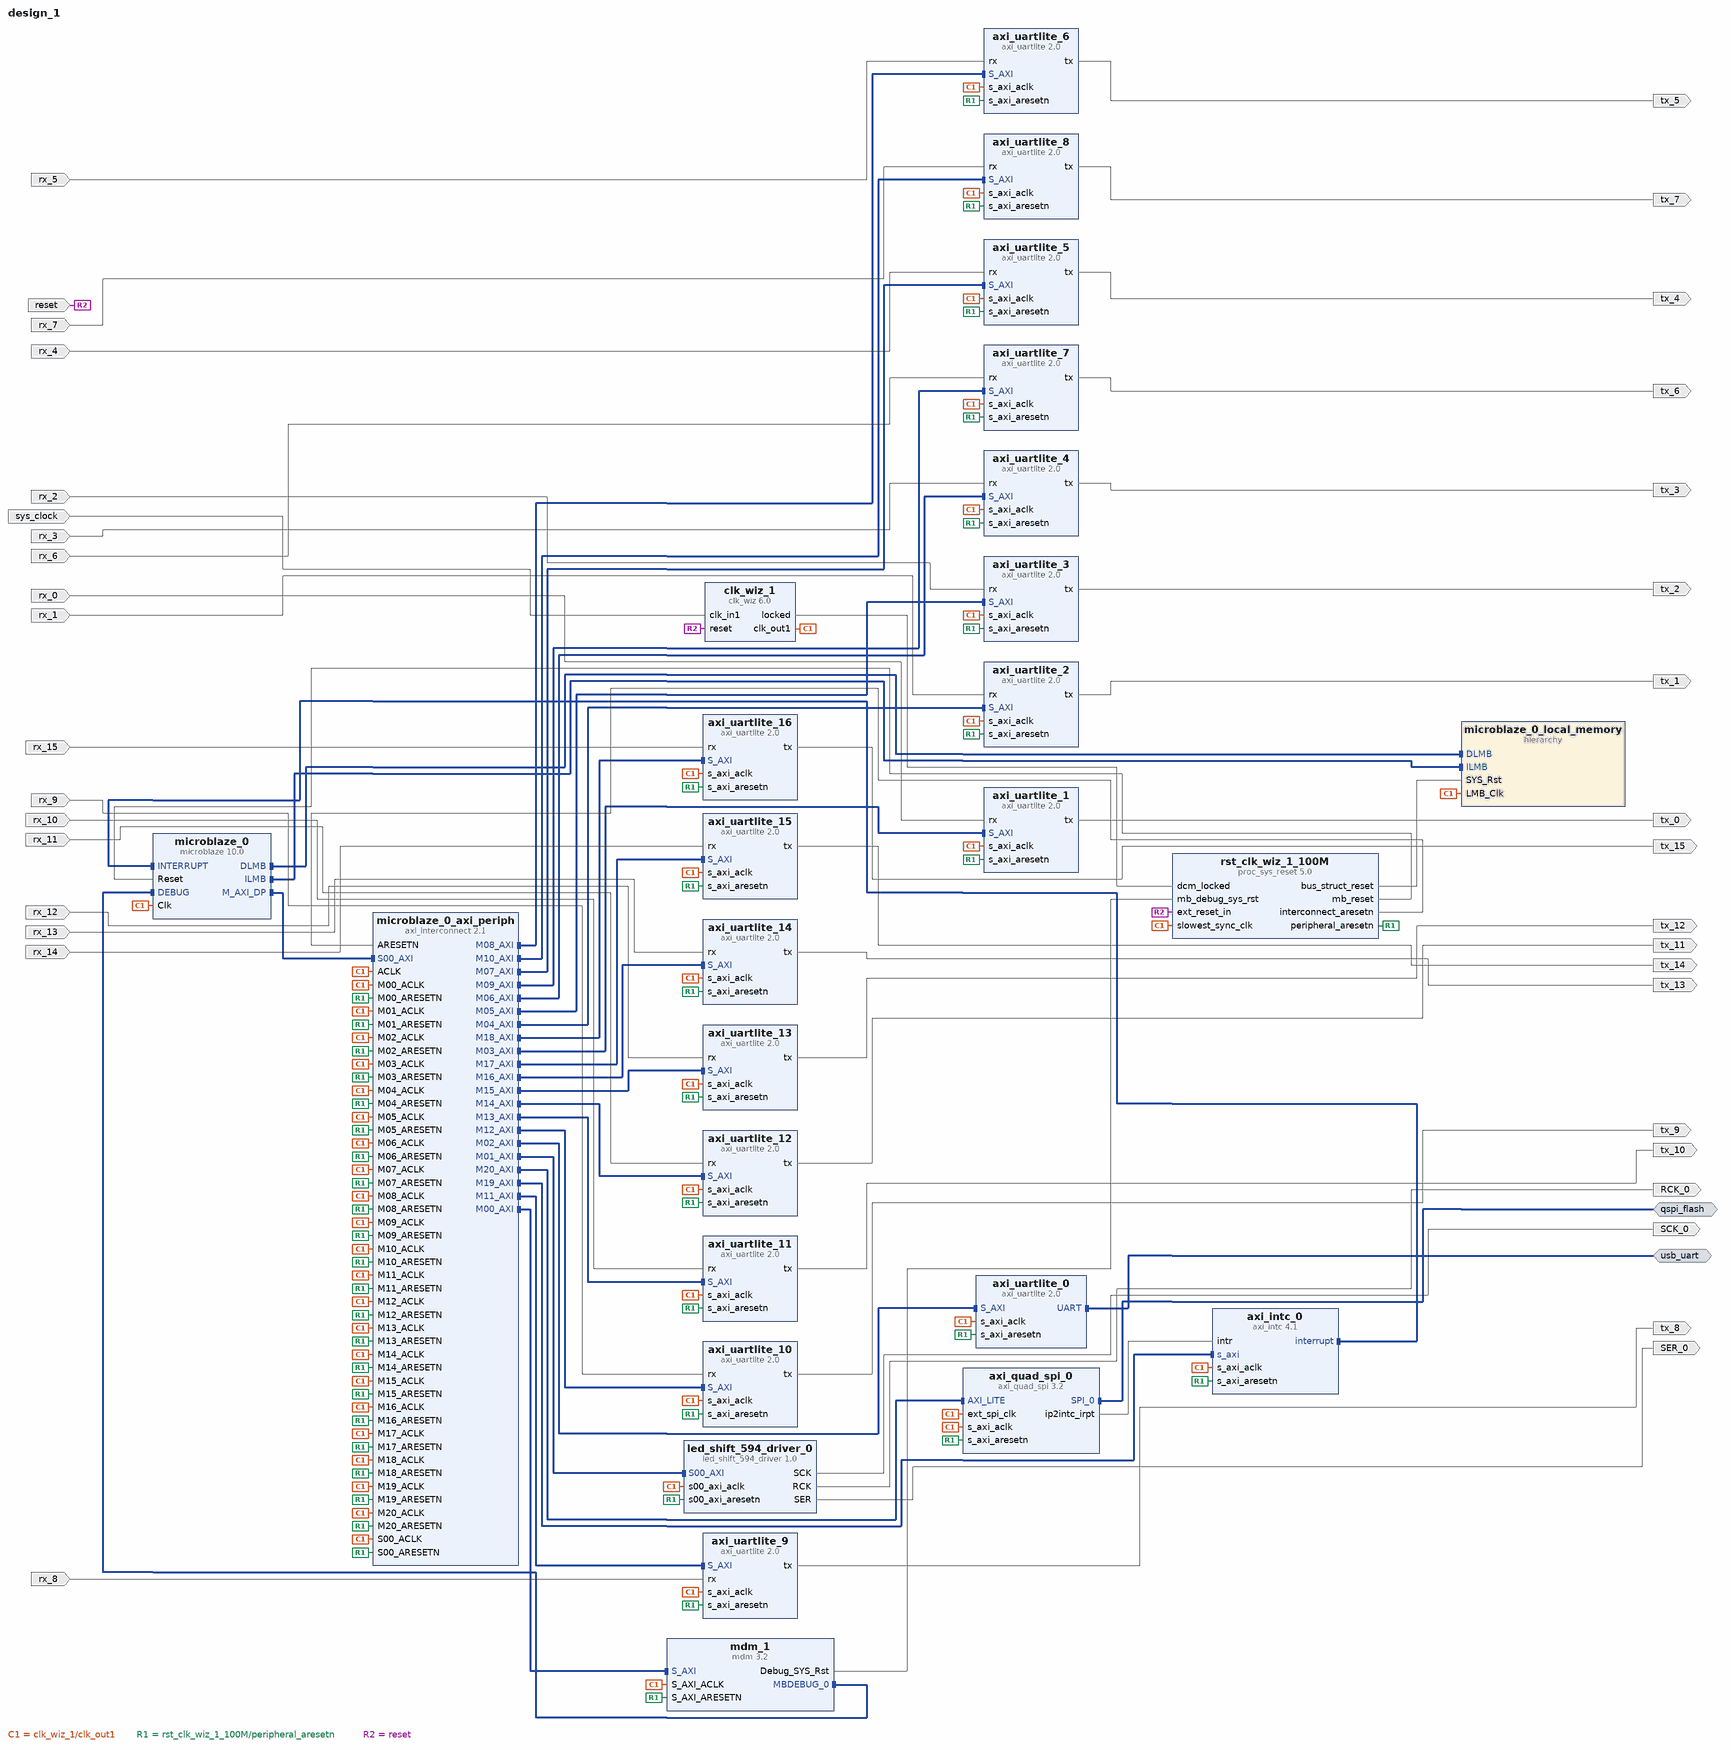
[diagram p0: block diagram of the top level]
# Vivado block design design_1, xc7a35tcpg236-1, Vivado 2018.2
create_bd_design design_1

create_bd_intf_port -mode Master -vlnv xilinx.com:interface:uart_rtl:1.0 usb_uart
create_bd_intf_port -mode Master -vlnv xilinx.com:interface:spi_rtl:1.0 qspi_flash
create_bd_port -dir I -type rst reset
set_property -dict {CONFIG.POLARITY ACTIVE_HIGH} [get_bd_ports reset]
create_bd_port -dir O SCK_0
create_bd_port -dir O RCK_0
create_bd_port -dir O SER_0
create_bd_port -dir I -type clk sys_clock
set_property -dict {CONFIG.FREQ_HZ 12000000 CONFIG.PHASE 0.000} [get_bd_ports sys_clock]
create_bd_port -dir I rx_0
create_bd_port -dir O tx_0
create_bd_port -dir I rx_1
create_bd_port -dir O tx_1
create_bd_port -dir I rx_2
create_bd_port -dir O tx_2
create_bd_port -dir I rx_3
create_bd_port -dir O tx_3
create_bd_port -dir I rx_4
create_bd_port -dir O tx_4
create_bd_port -dir I rx_5
create_bd_port -dir O tx_5
create_bd_port -dir I rx_6
create_bd_port -dir O tx_6
create_bd_port -dir I rx_7
create_bd_port -dir O tx_7
create_bd_port -dir I rx_8
create_bd_port -dir O tx_8
create_bd_port -dir I rx_9
create_bd_port -dir O tx_9
create_bd_port -dir I rx_10
create_bd_port -dir O tx_10
create_bd_port -dir I rx_11
create_bd_port -dir O tx_11
create_bd_port -dir I rx_12
create_bd_port -dir O tx_12
create_bd_port -dir I rx_13
create_bd_port -dir O tx_13
create_bd_port -dir I rx_14
create_bd_port -dir O tx_14
create_bd_port -dir I rx_15
create_bd_port -dir O tx_15

create_bd_cell -type hier microblaze_0_local_memory
create_bd_cell -type ip -vlnv xilinx.com:ip:axi_intc:4.1 axi_intc_0
create_bd_cell -type ip -vlnv xilinx.com:ip:axi_quad_spi:3.2 axi_quad_spi_0
set_property -dict [list \
  CONFIG.C_SPI_MEMORY 2 \
  CONFIG.C_SPI_MODE 2 \
  CONFIG.USE_BOARD_FLOW true \
  CONFIG.QSPI_BOARD_INTERFACE qspi_flash \
  CONFIG.C_S_AXI4_ID_WIDTH 0 \
] [get_bd_cells axi_quad_spi_0]
create_bd_cell -type ip -vlnv xilinx.com:ip:axi_uartlite:2.0 axi_uartlite_0
set_property -dict {CONFIG.USE_BOARD_FLOW true CONFIG.UARTLITE_BOARD_INTERFACE usb_uart} [get_bd_cells axi_uartlite_0]
create_bd_cell -type ip -vlnv xilinx.com:ip:axi_uartlite:2.0 axi_uartlite_10
set_property -dict {CONFIG.C_BAUDRATE 31250} [get_bd_cells axi_uartlite_10]
create_bd_cell -type ip -vlnv xilinx.com:ip:axi_uartlite:2.0 axi_uartlite_11
set_property -dict {CONFIG.C_BAUDRATE 31250} [get_bd_cells axi_uartlite_11]
create_bd_cell -type ip -vlnv xilinx.com:ip:axi_uartlite:2.0 axi_uartlite_12
set_property -dict {CONFIG.C_BAUDRATE 31250} [get_bd_cells axi_uartlite_12]
create_bd_cell -type ip -vlnv xilinx.com:ip:axi_uartlite:2.0 axi_uartlite_13
set_property -dict {CONFIG.C_BAUDRATE 31250} [get_bd_cells axi_uartlite_13]
create_bd_cell -type ip -vlnv xilinx.com:ip:axi_uartlite:2.0 axi_uartlite_14
set_property -dict {CONFIG.C_BAUDRATE 31250} [get_bd_cells axi_uartlite_14]
create_bd_cell -type ip -vlnv xilinx.com:ip:axi_uartlite:2.0 axi_uartlite_15
set_property -dict {CONFIG.C_BAUDRATE 31250} [get_bd_cells axi_uartlite_15]
create_bd_cell -type ip -vlnv xilinx.com:ip:axi_uartlite:2.0 axi_uartlite_16
set_property -dict {CONFIG.C_BAUDRATE 31250} [get_bd_cells axi_uartlite_16]
create_bd_cell -type ip -vlnv xilinx.com:ip:axi_uartlite:2.0 axi_uartlite_1
set_property -dict {CONFIG.C_BAUDRATE 31250} [get_bd_cells axi_uartlite_1]
create_bd_cell -type ip -vlnv xilinx.com:ip:axi_uartlite:2.0 axi_uartlite_2
set_property -dict {CONFIG.C_BAUDRATE 31250} [get_bd_cells axi_uartlite_2]
create_bd_cell -type ip -vlnv xilinx.com:ip:axi_uartlite:2.0 axi_uartlite_3
set_property -dict {CONFIG.C_BAUDRATE 31250} [get_bd_cells axi_uartlite_3]
create_bd_cell -type ip -vlnv xilinx.com:ip:axi_uartlite:2.0 axi_uartlite_4
set_property -dict {CONFIG.C_BAUDRATE 31250} [get_bd_cells axi_uartlite_4]
create_bd_cell -type ip -vlnv xilinx.com:ip:axi_uartlite:2.0 axi_uartlite_5
set_property -dict {CONFIG.C_BAUDRATE 31250} [get_bd_cells axi_uartlite_5]
create_bd_cell -type ip -vlnv xilinx.com:ip:axi_uartlite:2.0 axi_uartlite_6
set_property -dict {CONFIG.C_BAUDRATE 31250} [get_bd_cells axi_uartlite_6]
create_bd_cell -type ip -vlnv xilinx.com:ip:axi_uartlite:2.0 axi_uartlite_7
set_property -dict {CONFIG.C_BAUDRATE 31250} [get_bd_cells axi_uartlite_7]
create_bd_cell -type ip -vlnv xilinx.com:ip:axi_uartlite:2.0 axi_uartlite_8
set_property -dict {CONFIG.C_BAUDRATE 31250} [get_bd_cells axi_uartlite_8]
create_bd_cell -type ip -vlnv xilinx.com:ip:axi_uartlite:2.0 axi_uartlite_9
set_property -dict {CONFIG.C_BAUDRATE 31250} [get_bd_cells axi_uartlite_9]
create_bd_cell -type ip -vlnv xilinx.com:ip:clk_wiz:6.0 clk_wiz_1
set_property -dict [list \
  CONFIG.PRIM_IN_FREQ 12.000 \
  CONFIG.CLKIN1_JITTER_PS 833.33 \
  CONFIG.PRIM_SOURCE Single_ended_clock_capable_pin \
  CONFIG.MMCM_DIVCLK_DIVIDE 1 \
  CONFIG.MMCM_CLKFBOUT_MULT_F 62.500 \
  CONFIG.MMCM_CLKIN1_PERIOD 83.333 \
  CONFIG.MMCM_CLKIN2_PERIOD 10.0 \
  CONFIG.MMCM_CLKOUT0_DIVIDE_F 7.500 \
  CONFIG.USE_BOARD_FLOW true \
  CONFIG.CLK_IN1_BOARD_INTERFACE sys_clock \
  CONFIG.RESET_BOARD_INTERFACE reset \
  CONFIG.CLKOUT1_JITTER 479.872 \
  CONFIG.CLKOUT1_PHASE_ERROR 668.310 \
] [get_bd_cells clk_wiz_1]
create_bd_cell -type ip -vlnv xilinx.com:ip:mdm:3.2 mdm_1
set_property -dict {CONFIG.C_USE_UART 1} [get_bd_cells mdm_1]
create_bd_cell -type ip -vlnv xilinx.com:ip:microblaze:10.0 microblaze_0
set_property -dict {CONFIG.C_D_AXI 1 CONFIG.C_D_LMB 1 CONFIG.C_I_LMB 1 CONFIG.C_DEBUG_ENABLED 1} [get_bd_cells microblaze_0]
create_bd_cell -type ip -vlnv xilinx.com:ip:axi_interconnect:2.1 microblaze_0_axi_periph
set_property -dict {CONFIG.NUM_MI 21} [get_bd_cells microblaze_0_axi_periph]
create_bd_cell -type ip -vlnv xilinx.com:ip:proc_sys_reset:5.0 rst_clk_wiz_1_100M
set_property -dict {CONFIG.USE_BOARD_FLOW true CONFIG.RESET_BOARD_INTERFACE reset} [get_bd_cells rst_clk_wiz_1_100M]
create_bd_cell -type ip -vlnv user.org:user:led_shift_594_driver:1.0 led_shift_594_driver_0
set_property -dict [list \
  CONFIG.ANIMATION_IDLE_WIDTH 31 \
  CONFIG.ANIMATION_CLOCK_WIDTH 23 \
  CONFIG.SHIFT_DELAY_WIDTH 11 \
  CONFIG.LED_DELAY_WIDTH 2 \
  CONFIG.LED_CLOCK_WIDTH 19 \
] [get_bd_cells led_shift_594_driver_0]

# ---- hierarchy /microblaze_0_local_memory ----
current_bd_instance /microblaze_0_local_memory
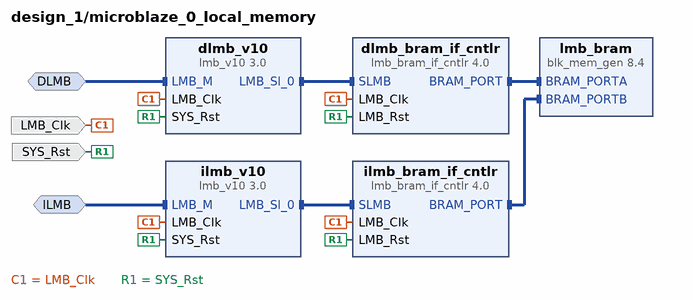
[diagram p1: block diagram inside /microblaze_0_local_memory]
create_bd_intf_pin -mode MirroredMaster -vlnv xilinx.com:interface:lmb_rtl:1.0 DLMB
create_bd_intf_pin -mode MirroredMaster -vlnv xilinx.com:interface:lmb_rtl:1.0 ILMB
create_bd_pin -dir I -type clk LMB_Clk
create_bd_pin -dir I -type rst SYS_Rst

create_bd_cell -type ip -vlnv xilinx.com:ip:lmb_bram_if_cntlr:4.0 dlmb_bram_if_cntlr
set_property -dict {CONFIG.C_ECC 0} [get_bd_cells dlmb_bram_if_cntlr]
create_bd_cell -type ip -vlnv xilinx.com:ip:lmb_v10:3.0 dlmb_v10
create_bd_cell -type ip -vlnv xilinx.com:ip:lmb_bram_if_cntlr:4.0 ilmb_bram_if_cntlr
set_property -dict {CONFIG.C_ECC 0} [get_bd_cells ilmb_bram_if_cntlr]
create_bd_cell -type ip -vlnv xilinx.com:ip:lmb_v10:3.0 ilmb_v10
create_bd_cell -type ip -vlnv xilinx.com:ip:blk_mem_gen:8.4 lmb_bram
set_property -dict [list \
  CONFIG.Memory_Type True_Dual_Port_RAM \
  CONFIG.Enable_B Use_ENB_Pin \
  CONFIG.Use_RSTB_Pin true \
  CONFIG.Port_B_Clock 100 \
  CONFIG.Port_B_Write_Rate 50 \
  CONFIG.Port_B_Enable_Rate 100 \
  CONFIG.use_bram_block BRAM_Controller \
] [get_bd_cells lmb_bram]

# ---- connections ----

current_bd_instance /microblaze_0_local_memory
connect_bd_intf_net -intf_net microblaze_0_dlmb_bus [get_bd_intf_pins dlmb_v10/LMB_Sl_0] [get_bd_intf_pins dlmb_bram_if_cntlr/SLMB]
connect_bd_intf_net -intf_net microblaze_0_ilmb_bus [get_bd_intf_pins ilmb_v10/LMB_Sl_0] [get_bd_intf_pins ilmb_bram_if_cntlr/SLMB]
connect_bd_intf_net -intf_net microblaze_0_dlmb_cntlr [get_bd_intf_pins dlmb_bram_if_cntlr/BRAM_PORT] [get_bd_intf_pins lmb_bram/BRAM_PORTA]
connect_bd_intf_net -intf_net microblaze_0_ilmb_cntlr [get_bd_intf_pins ilmb_bram_if_cntlr/BRAM_PORT] [get_bd_intf_pins lmb_bram/BRAM_PORTB]
connect_bd_intf_net -intf_net microblaze_0_dlmb [get_bd_intf_pins DLMB] [get_bd_intf_pins dlmb_v10/LMB_M]
connect_bd_intf_net -intf_net microblaze_0_ilmb [get_bd_intf_pins ILMB] [get_bd_intf_pins ilmb_v10/LMB_M]
connect_bd_net -net microblaze_0_Clk [get_bd_pins LMB_Clk] \
  [get_bd_pins dlmb_bram_if_cntlr/LMB_Clk] [get_bd_pins dlmb_v10/LMB_Clk] [get_bd_pins ilmb_bram_if_cntlr/LMB_Clk] \
  [get_bd_pins ilmb_v10/LMB_Clk]
connect_bd_net [get_bd_pins SYS_Rst] \
  [get_bd_pins dlmb_bram_if_cntlr/LMB_Rst] [get_bd_pins dlmb_v10/SYS_Rst] [get_bd_pins ilmb_bram_if_cntlr/LMB_Rst] \
  [get_bd_pins ilmb_v10/SYS_Rst]

current_bd_instance /
connect_bd_intf_net [get_bd_intf_pins microblaze_0/DLMB] [get_bd_intf_pins microblaze_0_local_memory/DLMB]
connect_bd_intf_net [get_bd_intf_pins microblaze_0/ILMB] [get_bd_intf_pins microblaze_0_local_memory/ILMB]
connect_bd_intf_net -intf_net microblaze_0_axi_dp [get_bd_intf_pins microblaze_0_axi_periph/S00_AXI] [get_bd_intf_pins microblaze_0/M_AXI_DP]
connect_bd_intf_net [get_bd_intf_pins mdm_1/MBDEBUG_0] [get_bd_intf_pins microblaze_0/DEBUG]
connect_bd_intf_net -intf_net microblaze_0_mdm_axi [get_bd_intf_pins microblaze_0_axi_periph/M00_AXI] [get_bd_intf_pins mdm_1/S_AXI]
connect_bd_intf_net [get_bd_intf_pins microblaze_0_axi_periph/M01_AXI] [get_bd_intf_pins led_shift_594_driver_0/S00_AXI]
connect_bd_intf_net [get_bd_intf_pins microblaze_0_axi_periph/M02_AXI] [get_bd_intf_pins axi_uartlite_0/S_AXI]
connect_bd_intf_net [get_bd_intf_pins microblaze_0_axi_periph/M03_AXI] [get_bd_intf_pins axi_uartlite_1/S_AXI]
connect_bd_intf_net [get_bd_intf_pins microblaze_0_axi_periph/M04_AXI] [get_bd_intf_pins axi_uartlite_2/S_AXI]
connect_bd_intf_net [get_bd_intf_pins microblaze_0_axi_periph/M05_AXI] [get_bd_intf_pins axi_uartlite_3/S_AXI]
connect_bd_intf_net [get_bd_intf_pins microblaze_0_axi_periph/M06_AXI] [get_bd_intf_pins axi_uartlite_4/S_AXI]
connect_bd_intf_net [get_bd_intf_pins microblaze_0_axi_periph/M07_AXI] [get_bd_intf_pins axi_uartlite_5/S_AXI]
connect_bd_intf_net [get_bd_intf_pins microblaze_0_axi_periph/M08_AXI] [get_bd_intf_pins axi_uartlite_6/S_AXI]
connect_bd_intf_net [get_bd_intf_pins microblaze_0_axi_periph/M09_AXI] [get_bd_intf_pins axi_uartlite_7/S_AXI]
connect_bd_intf_net [get_bd_intf_pins microblaze_0_axi_periph/M10_AXI] [get_bd_intf_pins axi_uartlite_8/S_AXI]
connect_bd_intf_net [get_bd_intf_pins microblaze_0_axi_periph/M11_AXI] [get_bd_intf_pins axi_uartlite_9/S_AXI]
connect_bd_intf_net [get_bd_intf_pins microblaze_0_axi_periph/M12_AXI] [get_bd_intf_pins axi_uartlite_10/S_AXI]
connect_bd_intf_net [get_bd_intf_pins microblaze_0_axi_periph/M13_AXI] [get_bd_intf_pins axi_uartlite_11/S_AXI]
connect_bd_intf_net [get_bd_intf_pins microblaze_0_axi_periph/M14_AXI] [get_bd_intf_pins axi_uartlite_12/S_AXI]
connect_bd_intf_net [get_bd_intf_pins microblaze_0_axi_periph/M15_AXI] [get_bd_intf_pins axi_uartlite_13/S_AXI]
connect_bd_intf_net [get_bd_intf_pins microblaze_0_axi_periph/M16_AXI] [get_bd_intf_pins axi_uartlite_14/S_AXI]
connect_bd_intf_net [get_bd_intf_pins microblaze_0_axi_periph/M17_AXI] [get_bd_intf_pins axi_uartlite_15/S_AXI]
connect_bd_intf_net [get_bd_intf_pins microblaze_0_axi_periph/M18_AXI] [get_bd_intf_pins axi_uartlite_16/S_AXI]
connect_bd_intf_net [get_bd_intf_pins microblaze_0_axi_periph/M19_AXI] [get_bd_intf_pins axi_intc_0/s_axi]
connect_bd_intf_net [get_bd_intf_pins microblaze_0_axi_periph/M20_AXI] [get_bd_intf_pins axi_quad_spi_0/AXI_LITE]
connect_bd_intf_net [get_bd_intf_pins axi_intc_0/interrupt] [get_bd_intf_pins microblaze_0/INTERRUPT]
connect_bd_intf_net [get_bd_intf_ports usb_uart] [get_bd_intf_pins axi_uartlite_0/UART]
connect_bd_intf_net [get_bd_intf_ports qspi_flash] [get_bd_intf_pins axi_quad_spi_0/SPI_0]
connect_bd_net -net microblaze_0_Clk [get_bd_pins clk_wiz_1/clk_out1] \
  [get_bd_pins axi_intc_0/s_axi_aclk] [get_bd_pins axi_quad_spi_0/ext_spi_clk] [get_bd_pins axi_quad_spi_0/s_axi_aclk] \
  [get_bd_pins axi_uartlite_0/s_axi_aclk] [get_bd_pins axi_uartlite_10/s_axi_aclk] [get_bd_pins axi_uartlite_11/s_axi_aclk] \
  [get_bd_pins axi_uartlite_12/s_axi_aclk] [get_bd_pins axi_uartlite_13/s_axi_aclk] [get_bd_pins axi_uartlite_14/s_axi_aclk] \
  [get_bd_pins axi_uartlite_15/s_axi_aclk] [get_bd_pins axi_uartlite_16/s_axi_aclk] [get_bd_pins axi_uartlite_1/s_axi_aclk] \
  [get_bd_pins axi_uartlite_2/s_axi_aclk] [get_bd_pins axi_uartlite_3/s_axi_aclk] [get_bd_pins axi_uartlite_4/s_axi_aclk] \
  [get_bd_pins axi_uartlite_5/s_axi_aclk] [get_bd_pins axi_uartlite_6/s_axi_aclk] [get_bd_pins axi_uartlite_7/s_axi_aclk] \
  [get_bd_pins axi_uartlite_8/s_axi_aclk] [get_bd_pins axi_uartlite_9/s_axi_aclk] [get_bd_pins mdm_1/S_AXI_ACLK] \
  [get_bd_pins microblaze_0/Clk] [get_bd_pins rst_clk_wiz_1_100M/slowest_sync_clk] \
  [get_bd_pins microblaze_0_local_memory/LMB_Clk] [get_bd_pins microblaze_0_axi_periph/ACLK] \
  [get_bd_pins microblaze_0_axi_periph/S00_ACLK] [get_bd_pins microblaze_0_axi_periph/M00_ACLK] \
  [get_bd_pins microblaze_0_axi_periph/M01_ACLK] [get_bd_pins microblaze_0_axi_periph/M02_ACLK] \
  [get_bd_pins microblaze_0_axi_periph/M03_ACLK] [get_bd_pins microblaze_0_axi_periph/M04_ACLK] \
  [get_bd_pins microblaze_0_axi_periph/M05_ACLK] [get_bd_pins microblaze_0_axi_periph/M06_ACLK] \
  [get_bd_pins microblaze_0_axi_periph/M07_ACLK] [get_bd_pins microblaze_0_axi_periph/M08_ACLK] \
  [get_bd_pins microblaze_0_axi_periph/M09_ACLK] [get_bd_pins microblaze_0_axi_periph/M10_ACLK] \
  [get_bd_pins microblaze_0_axi_periph/M11_ACLK] [get_bd_pins microblaze_0_axi_periph/M12_ACLK] \
  [get_bd_pins microblaze_0_axi_periph/M13_ACLK] [get_bd_pins microblaze_0_axi_periph/M14_ACLK] \
  [get_bd_pins microblaze_0_axi_periph/M15_ACLK] [get_bd_pins microblaze_0_axi_periph/M16_ACLK] \
  [get_bd_pins microblaze_0_axi_periph/M17_ACLK] [get_bd_pins microblaze_0_axi_periph/M18_ACLK] \
  [get_bd_pins microblaze_0_axi_periph/M19_ACLK] [get_bd_pins microblaze_0_axi_periph/M20_ACLK] \
  [get_bd_pins led_shift_594_driver_0/s00_axi_aclk]
connect_bd_net [get_bd_pins clk_wiz_1/locked] [get_bd_pins rst_clk_wiz_1_100M/dcm_locked]
connect_bd_net [get_bd_pins rst_clk_wiz_1_100M/mb_reset] [get_bd_pins microblaze_0/Reset]
connect_bd_net [get_bd_pins rst_clk_wiz_1_100M/bus_struct_reset] [get_bd_pins microblaze_0_local_memory/SYS_Rst]
connect_bd_net [get_bd_pins rst_clk_wiz_1_100M/interconnect_aresetn] [get_bd_pins microblaze_0_axi_periph/ARESETN]
connect_bd_net [get_bd_pins rst_clk_wiz_1_100M/peripheral_aresetn] \
  [get_bd_pins axi_intc_0/s_axi_aresetn] [get_bd_pins axi_quad_spi_0/s_axi_aresetn] \
  [get_bd_pins axi_uartlite_0/s_axi_aresetn] [get_bd_pins axi_uartlite_10/s_axi_aresetn] \
  [get_bd_pins axi_uartlite_11/s_axi_aresetn] [get_bd_pins axi_uartlite_12/s_axi_aresetn] \
  [get_bd_pins axi_uartlite_13/s_axi_aresetn] [get_bd_pins axi_uartlite_14/s_axi_aresetn] \
  [get_bd_pins axi_uartlite_15/s_axi_aresetn] [get_bd_pins axi_uartlite_16/s_axi_aresetn] \
  [get_bd_pins axi_uartlite_1/s_axi_aresetn] [get_bd_pins axi_uartlite_2/s_axi_aresetn] \
  [get_bd_pins axi_uartlite_3/s_axi_aresetn] [get_bd_pins axi_uartlite_4/s_axi_aresetn] \
  [get_bd_pins axi_uartlite_5/s_axi_aresetn] [get_bd_pins axi_uartlite_6/s_axi_aresetn] \
  [get_bd_pins axi_uartlite_7/s_axi_aresetn] [get_bd_pins axi_uartlite_8/s_axi_aresetn] \
  [get_bd_pins axi_uartlite_9/s_axi_aresetn] [get_bd_pins mdm_1/S_AXI_ARESETN] \
  [get_bd_pins microblaze_0_axi_periph/S00_ARESETN] [get_bd_pins microblaze_0_axi_periph/M00_ARESETN] \
  [get_bd_pins microblaze_0_axi_periph/M01_ARESETN] [get_bd_pins microblaze_0_axi_periph/M02_ARESETN] \
  [get_bd_pins microblaze_0_axi_periph/M03_ARESETN] [get_bd_pins microblaze_0_axi_periph/M04_ARESETN] \
  [get_bd_pins microblaze_0_axi_periph/M05_ARESETN] [get_bd_pins microblaze_0_axi_periph/M06_ARESETN] \
  [get_bd_pins microblaze_0_axi_periph/M07_ARESETN] [get_bd_pins microblaze_0_axi_periph/M08_ARESETN] \
  [get_bd_pins microblaze_0_axi_periph/M09_ARESETN] [get_bd_pins microblaze_0_axi_periph/M10_ARESETN] \
  [get_bd_pins microblaze_0_axi_periph/M11_ARESETN] [get_bd_pins microblaze_0_axi_periph/M12_ARESETN] \
  [get_bd_pins microblaze_0_axi_periph/M13_ARESETN] [get_bd_pins microblaze_0_axi_periph/M14_ARESETN] \
  [get_bd_pins microblaze_0_axi_periph/M15_ARESETN] [get_bd_pins microblaze_0_axi_periph/M16_ARESETN] \
  [get_bd_pins microblaze_0_axi_periph/M17_ARESETN] [get_bd_pins microblaze_0_axi_periph/M18_ARESETN] \
  [get_bd_pins microblaze_0_axi_periph/M19_ARESETN] [get_bd_pins microblaze_0_axi_periph/M20_ARESETN] \
  [get_bd_pins led_shift_594_driver_0/s00_axi_aresetn]
connect_bd_net [get_bd_pins mdm_1/Debug_SYS_Rst] [get_bd_pins rst_clk_wiz_1_100M/mb_debug_sys_rst]
connect_bd_net [get_bd_ports reset] [get_bd_pins clk_wiz_1/reset] [get_bd_pins rst_clk_wiz_1_100M/ext_reset_in]
connect_bd_net [get_bd_pins led_shift_594_driver_0/SCK] [get_bd_ports SCK_0]
connect_bd_net [get_bd_pins led_shift_594_driver_0/RCK] [get_bd_ports RCK_0]
connect_bd_net [get_bd_pins led_shift_594_driver_0/SER] [get_bd_ports SER_0]
connect_bd_net [get_bd_ports sys_clock] [get_bd_pins clk_wiz_1/clk_in1]
connect_bd_net -net rx_0_1 [get_bd_ports rx_0] [get_bd_pins axi_uartlite_1/rx]
connect_bd_net [get_bd_pins axi_uartlite_1/tx] [get_bd_ports tx_0]
connect_bd_net -net rx_1_1 [get_bd_ports rx_1] [get_bd_pins axi_uartlite_2/rx]
connect_bd_net [get_bd_pins axi_uartlite_2/tx] [get_bd_ports tx_1]
connect_bd_net -net rx_2_1 [get_bd_ports rx_2] [get_bd_pins axi_uartlite_3/rx]
connect_bd_net [get_bd_pins axi_uartlite_3/tx] [get_bd_ports tx_2]
connect_bd_net -net rx_3_1 [get_bd_ports rx_3] [get_bd_pins axi_uartlite_4/rx]
connect_bd_net [get_bd_pins axi_uartlite_4/tx] [get_bd_ports tx_3]
connect_bd_net -net rx_4_1 [get_bd_ports rx_4] [get_bd_pins axi_uartlite_5/rx]
connect_bd_net [get_bd_pins axi_uartlite_5/tx] [get_bd_ports tx_4]
connect_bd_net -net rx_5_1 [get_bd_ports rx_5] [get_bd_pins axi_uartlite_6/rx]
connect_bd_net [get_bd_pins axi_uartlite_6/tx] [get_bd_ports tx_5]
connect_bd_net -net rx_6_1 [get_bd_ports rx_6] [get_bd_pins axi_uartlite_7/rx]
connect_bd_net [get_bd_pins axi_uartlite_7/tx] [get_bd_ports tx_6]
connect_bd_net -net rx_7_1 [get_bd_ports rx_7] [get_bd_pins axi_uartlite_8/rx]
connect_bd_net [get_bd_pins axi_uartlite_8/tx] [get_bd_ports tx_7]
connect_bd_net -net rx_8_1 [get_bd_ports rx_8] [get_bd_pins axi_uartlite_9/rx]
connect_bd_net [get_bd_pins axi_uartlite_9/tx] [get_bd_ports tx_8]
connect_bd_net -net rx_9_1 [get_bd_ports rx_9] [get_bd_pins axi_uartlite_10/rx]
connect_bd_net [get_bd_pins axi_uartlite_10/tx] [get_bd_ports tx_9]
connect_bd_net -net rx_10_1 [get_bd_ports rx_10] [get_bd_pins axi_uartlite_11/rx]
connect_bd_net [get_bd_pins axi_uartlite_11/tx] [get_bd_ports tx_10]
connect_bd_net -net rx_11_1 [get_bd_ports rx_11] [get_bd_pins axi_uartlite_12/rx]
connect_bd_net [get_bd_pins axi_uartlite_12/tx] [get_bd_ports tx_11]
connect_bd_net -net rx_12_1 [get_bd_ports rx_12] [get_bd_pins axi_uartlite_13/rx]
connect_bd_net [get_bd_pins axi_uartlite_13/tx] [get_bd_ports tx_12]
connect_bd_net -net rx_13_1 [get_bd_ports rx_13] [get_bd_pins axi_uartlite_14/rx]
connect_bd_net [get_bd_pins axi_uartlite_14/tx] [get_bd_ports tx_13]
connect_bd_net -net rx_14_1 [get_bd_ports rx_14] [get_bd_pins axi_uartlite_15/rx]
connect_bd_net [get_bd_pins axi_uartlite_15/tx] [get_bd_ports tx_14]
connect_bd_net -net rx_15_1 [get_bd_ports rx_15] [get_bd_pins axi_uartlite_16/rx]
connect_bd_net [get_bd_pins axi_uartlite_16/tx] [get_bd_ports tx_15]
connect_bd_net [get_bd_pins axi_quad_spi_0/ip2intc_irpt] [get_bd_pins axi_intc_0/intr]

# ---- address map ----
assign_bd_address -offset 0x00000000 -range 64K -target_address_space [get_bd_addr_spaces microblaze_0/Data] [get_bd_addr_segs microblaze_0_local_memory/dlmb_bram_if_cntlr/SLMB/Mem]
assign_bd_address -offset 0x40600000 -range 64K -target_address_space [get_bd_addr_spaces microblaze_0/Data] [get_bd_addr_segs axi_uartlite_0/S_AXI/Reg]
assign_bd_address -offset 0x40610000 -range 64K -target_address_space [get_bd_addr_spaces microblaze_0/Data] [get_bd_addr_segs axi_uartlite_1/S_AXI/Reg]
assign_bd_address -offset 0x40620000 -range 64K -target_address_space [get_bd_addr_spaces microblaze_0/Data] [get_bd_addr_segs axi_uartlite_2/S_AXI/Reg]
assign_bd_address -offset 0x40630000 -range 64K -target_address_space [get_bd_addr_spaces microblaze_0/Data] [get_bd_addr_segs axi_uartlite_3/S_AXI/Reg]
assign_bd_address -offset 0x40640000 -range 64K -target_address_space [get_bd_addr_spaces microblaze_0/Data] [get_bd_addr_segs axi_uartlite_4/S_AXI/Reg]
assign_bd_address -offset 0x40650000 -range 64K -target_address_space [get_bd_addr_spaces microblaze_0/Data] [get_bd_addr_segs axi_uartlite_5/S_AXI/Reg]
assign_bd_address -offset 0x40660000 -range 64K -target_address_space [get_bd_addr_spaces microblaze_0/Data] [get_bd_addr_segs axi_uartlite_6/S_AXI/Reg]
assign_bd_address -offset 0x40670000 -range 64K -target_address_space [get_bd_addr_spaces microblaze_0/Data] [get_bd_addr_segs axi_uartlite_7/S_AXI/Reg]
assign_bd_address -offset 0x40680000 -range 64K -target_address_space [get_bd_addr_spaces microblaze_0/Data] [get_bd_addr_segs axi_uartlite_8/S_AXI/Reg]
assign_bd_address -offset 0x40690000 -range 64K -target_address_space [get_bd_addr_spaces microblaze_0/Data] [get_bd_addr_segs axi_uartlite_9/S_AXI/Reg]
assign_bd_address -offset 0x406A0000 -range 64K -target_address_space [get_bd_addr_spaces microblaze_0/Data] [get_bd_addr_segs axi_uartlite_10/S_AXI/Reg]
assign_bd_address -offset 0x406B0000 -range 64K -target_address_space [get_bd_addr_spaces microblaze_0/Data] [get_bd_addr_segs axi_uartlite_11/S_AXI/Reg]
assign_bd_address -offset 0x406C0000 -range 64K -target_address_space [get_bd_addr_spaces microblaze_0/Data] [get_bd_addr_segs axi_uartlite_12/S_AXI/Reg]
assign_bd_address -offset 0x406D0000 -range 64K -target_address_space [get_bd_addr_spaces microblaze_0/Data] [get_bd_addr_segs axi_uartlite_13/S_AXI/Reg]
assign_bd_address -offset 0x406E0000 -range 64K -target_address_space [get_bd_addr_spaces microblaze_0/Data] [get_bd_addr_segs axi_uartlite_14/S_AXI/Reg]
assign_bd_address -offset 0x406F0000 -range 64K -target_address_space [get_bd_addr_spaces microblaze_0/Data] [get_bd_addr_segs axi_uartlite_15/S_AXI/Reg]
assign_bd_address -offset 0x40700000 -range 64K -target_address_space [get_bd_addr_spaces microblaze_0/Data] [get_bd_addr_segs axi_uartlite_16/S_AXI/Reg]
assign_bd_address -offset 0x41200000 -range 64K -target_address_space [get_bd_addr_spaces microblaze_0/Data] [get_bd_addr_segs axi_intc_0/S_AXI/Reg]
assign_bd_address -offset 0x41400000 -range 4K -target_address_space [get_bd_addr_spaces microblaze_0/Data] [get_bd_addr_segs mdm_1/S_AXI/Reg]
assign_bd_address -offset 0x44A00000 -range 64K -target_address_space [get_bd_addr_spaces microblaze_0/Data] [get_bd_addr_segs led_shift_594_driver_0/S00_AXI/S00_AXI_reg]
assign_bd_address -offset 0x44A10000 -range 64K -target_address_space [get_bd_addr_spaces microblaze_0/Data] [get_bd_addr_segs axi_quad_spi_0/AXI_LITE/Reg]
assign_bd_address -offset 0x00000000 -range 64K -target_address_space [get_bd_addr_spaces microblaze_0/Instruction] [get_bd_addr_segs microblaze_0_local_memory/ilmb_bram_if_cntlr/SLMB/Mem]

validate_bd_design
save_bd_design
